# EAGLE design 250100020129x-HW-V2.2 (EAGLE 7.7.0)
Assembly variants: active
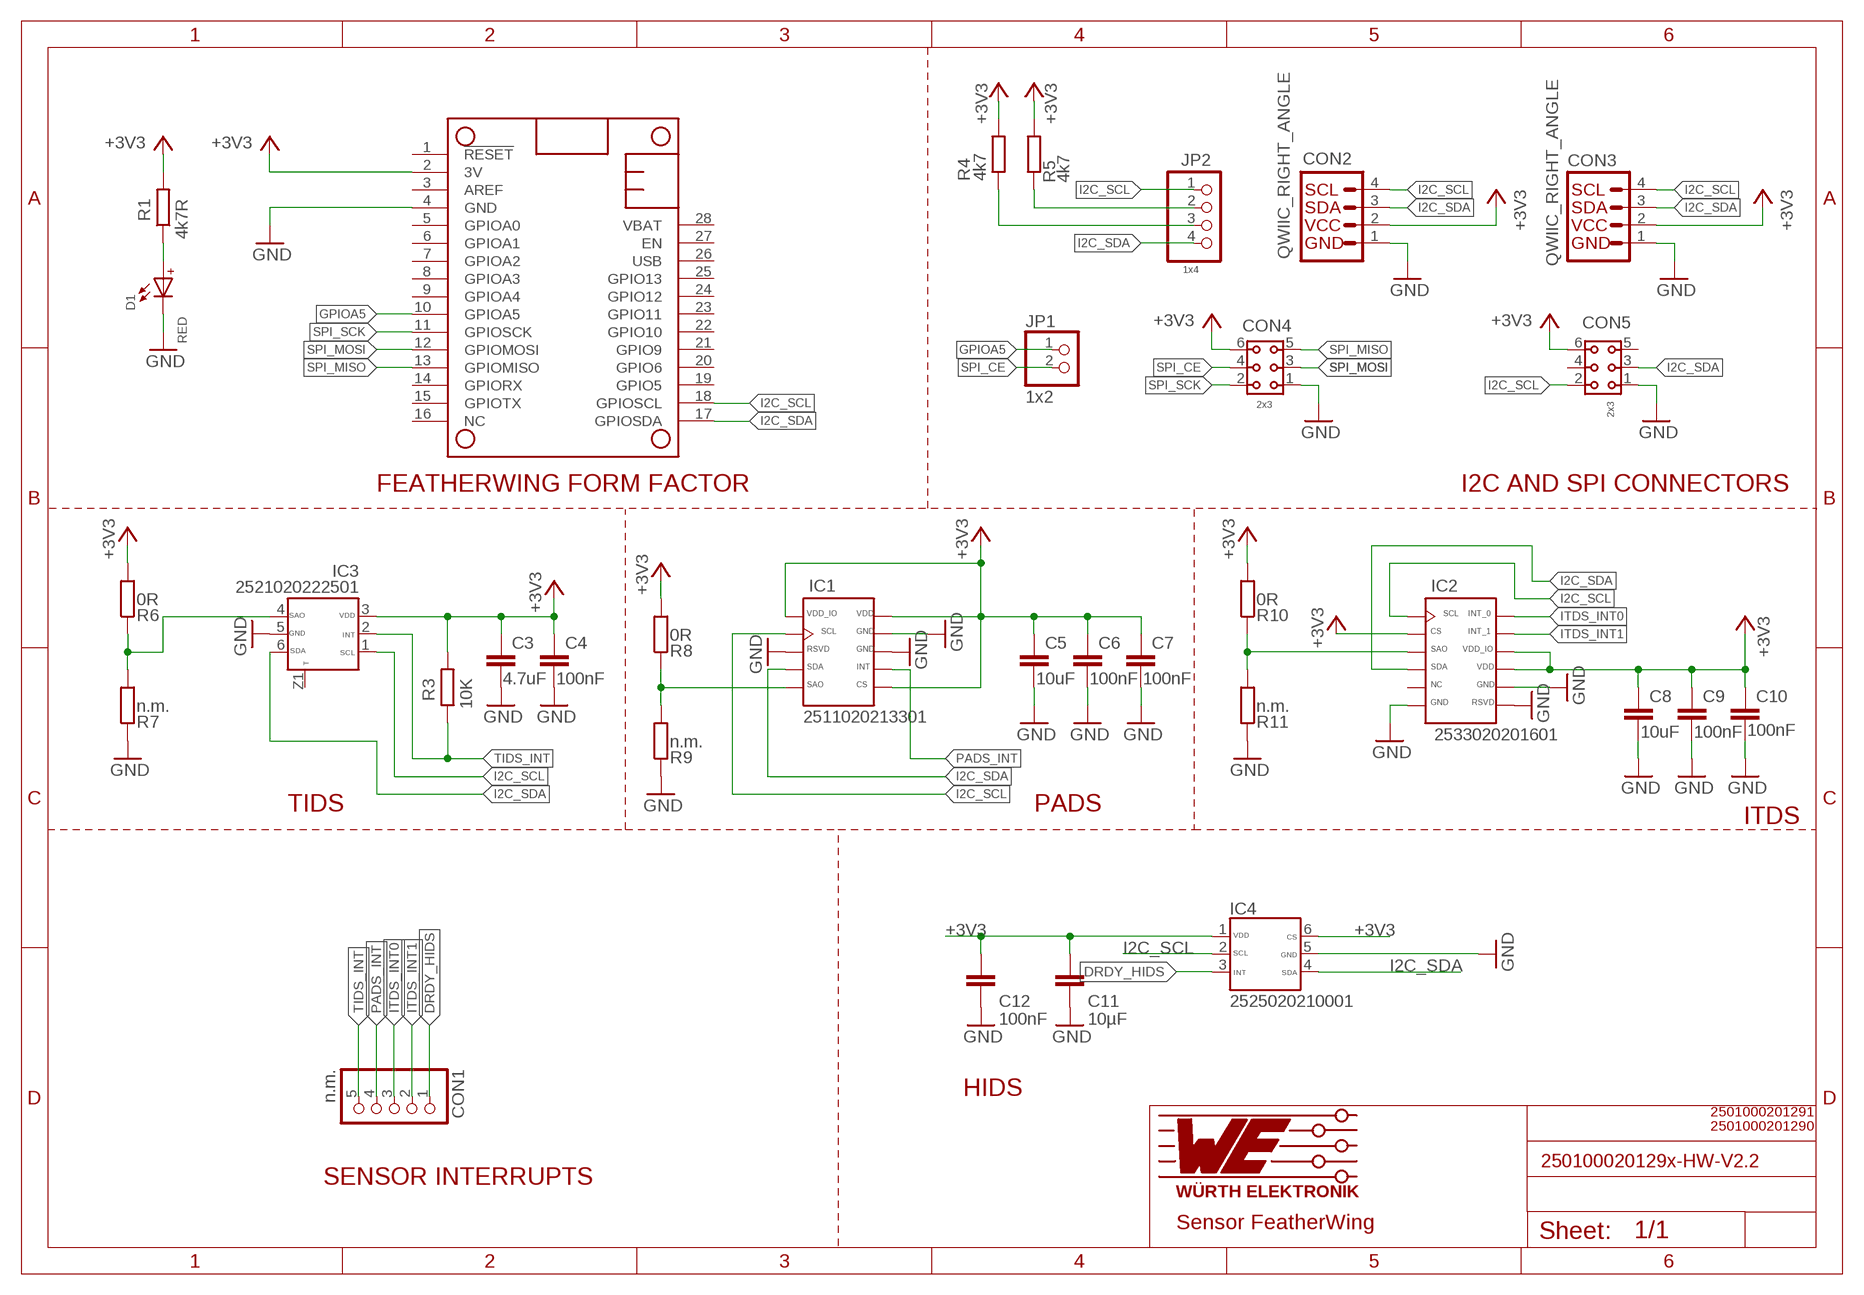
[diagram p0: schematic, sheet 1]

## Parts
C3  4.7uF  C4,7UF0402_IPC  [C0402_IPC]
C4  100nF  C100NF0402_IPC  [C0402_IPC]
C5  10uF  C10UF0402_IPC  [C0402_IPC]
C6  100nF  C100NF0402_IPC  [C0402_IPC]
C7  100nF  C100NF0402_IPC  [C0402_IPC]
C8  10uF  C10UF0402_IPC  [C0402_IPC]
C9  100nF  C100NF0402_IPC  [C0402_IPC]
C10  100nF  C100NF0402_IPC  [C0402_IPC]
C11  10µF  C10UF0402_IPC  [C0402_IPC]
C12  100nF  C100NF0402_IPC  [C0402_IPC]
CON1  n.m.  PINHD-1X5/R  [1X05/R]  (not fitted in variant active)
CON2  QWIIC_RIGHT_ANGLE  QWIIC_CONNECTORJS-1MM  [JST04_1MM_RA]
CON3  QWIIC_RIGHT_ANGLE  QWIIC_CONNECTORJS-1MM  [JST04_1MM_RA]  (not fitted in variant active)
CON4  2x3  6130XX243121_613006243121  [613006243121]  (not fitted in variant active)
CON5  2x3  6130XX243121_613006243121  [613006243121]
D1  RED  WL-SMSW_1204_155124VS73200  [WL-SMSW_1204_A]
IC1  2511020213301  WSEN-PADS_2511020213301  [WSEN-PADS_2511020213301]
IC2  2533020201601  WSEN-ITDS_2533020201601  [WSEN-ITDS_2533020201601]
IC3  2521020222501  WSEN-TIDS_2521020222501  [WSEN-TIDS_2521020222501]
IC4  2525020210001  WSEN-HIDS_2525020210001  [WSEN-HIDS_2525020210001]
JP1  1x2  PINHD-1X2/R  [1X02/R]
JP2  1x4  PINHD-1X4/R  [1X04/R]
MS1  FEATHERWING  [FEATHERWING]
R1  4k7R  R4K70402_IPC  [R0402_IPC]
R3  10K  R10KR0402_IPC  [R0402_IPC]
R4  4k7  R4K70402_IPC  [R0402_IPC]
R5  4k7  R4K70402_IPC  [R0402_IPC]
R6  0R  R0R0402_IPC  [R0402_IPC]
R7  n.m.  R0402_IPC  [R0402_IPC]
R8  0R  R0R0402_IPC  [R0402_IPC]
R9  n.m.  R0402_IPC  [R0402_IPC]
R10  0R  R0R0402_IPC  [R0402_IPC]
R11  n.m.  R0402_IPC  [R0402_IPC]

## Nets
+3V3: C3.1 C4.1 C5.1 C6.1 C7.1 C8.1 C9.1 C10.1 C11.2 C12.2 CON2.2 CON3.2 CON4.6 CON5.6 IC1.1(VDD_IO) IC1.6(CS) IC1.10(VDD) IC2.2(CS) IC2.9(VDD) IC2.10(VDD_IO) IC3.3(VDD) IC4.1(VDD) IC4.6(CS) MS1.2(3V) R1.2 R3.2 R4.2 R5.2 R6.2 R8.2 R10.2
DRDY_HIDS: CON1.1 IC4.3(INT)
GND: C3.2 C4.2 C5.2 C6.2 C7.2 C8.2 C9.2 C10.2 C11.1 C12.1 CON2.1 CON3.1 CON4.1 CON5.1 D1.1(-) IC1.3(RSVD) IC1.8(GND) IC1.9(GND) IC2.6(GND) IC2.7(RSVD) IC2.8(GND) IC3.5(GND) IC4.5(GND) MS1.4(GND) R7.1 R9.1 R11.1
GPIOA5: JP1.1 MS1.10(GPIOA5)
I2C_SCL: CON2.4 CON3.4 CON5.2 IC1.2(SCL) IC2.1(SCL) IC3.1(SCL) IC4.2(SCL) JP2.1 MS1.18(GPIOSCL)
I2C_SDA: CON2.3 CON3.3 CON5.3 IC1.4(SDA) IC2.4(SDA) IC3.6(SDA) IC4.4(SDA) JP2.4 MS1.17(GPIOSDA)
ITDS_INT0: CON1.3 IC2.12(INT_0)
ITDS_INT1: CON1.2 IC2.11(INT_1)
N$1: D1.2(+) R1.1
N$2: JP2.2 R5.1
N$3: JP2.3 R4.1
N$8: IC3.4(SAO) R6.1 R7.2
N$10: IC2.3(SAO) R10.1 R11.2
N$17: IC1.5(SAO) R8.1 R9.2
PADS_INT: CON1.4 IC1.7(INT)
SPI_CE: CON4.4 JP1.2
SPI_MISO: CON4.5 MS1.13(GPIOMISO)
SPI_MOSI: CON4.3 MS1.12(GPIOMOSI)
SPI_SCK: CON4.2 MS1.11(GPIOSCK)
TIDS_INT: CON1.5 IC3.2(INT) R3.1
Unconnected: CON5.4 CON5.5 IC2.5(NC) IC3.Z1 MS1.1(!RESET) MS1.3(AREF) MS1.5(GPIOA0) MS1.6(GPIOA1) MS1.7(GPIOA2) MS1.8(GPIOA3) MS1.9(GPIOA4) MS1.14(GPIORX) MS1.15(GPIOTX) MS1.16(NC) MS1.19(GPIO5) MS1.20(GPIO6) MS1.21(GPIO9) MS1.22(GPIO10) MS1.23(GPIO11) MS1.24(GPIO12) MS1.25(GPIO13) MS1.26(USB) MS1.27(EN) MS1.28(VBAT)

## Notes on the sheet
- FEATHERWING FORM FACTOR | I2C AND SPI CONNECTORS
- TIDS | PADS
- ITDS
- HIDS
- 2501000201291
- 2501000201290
- SENSOR INTERRUPTS
- Sensor FeatherWing

## Library data of the parts
C3 = rcl-amber:C; HEIGHT: 0.5mm; MANUFACTURER: Murata; MAT: X5R; NR: GRM155R60J475ME87J; PACK: 0402; SPG: 6.3V; TOL: 15%
C4 C6 C7 C9 C10 C12 = rcl-amber:C; HEIGHT: 0.5mm; MANUFACTURER: Yageo; MAT: X7R; NR: CC0402KRX7R7BB104; PACK: 0402; SPG: 16V; TOL: 10%
C5 C8 C11 = rcl-amber:C; HEIGHT: 0.5mm; MANUFACTURER: Murata; MAT: X5R; NR: GRM155R60J106ME15J; PACK: 0402; SPG: 6.3V; TOL: 20%
CON1 = pinhead:PINHD-1X5: PIN HEADER; HEIGHT: 8.54mm; MANUFACTURER: Würth Elektronik; NR: 61300511121; PACK: THT; PACKAGING: bag
CON2 CON3 = 250100020129x-HW-V2.0:QWIIC_CONNECTOR: SparkFun I2C Standard Qwiic Connector An SMD 1mm pitch JST connector makes it easy and quick (get it? Qwiic?) to connect I2C devices to each other. The Qwiic system <http://www.sparkfun.com/qwiic> enables fast and solderless connection between popular platforms and various sensors and actuators. We carry 200mm <https://www.sparkfun.com/products/14204>, 100mm <https://www.sparkfun.com/products/14205>, 50mm <https://www.sparkfun.com/products/14206>, and breadboard friendly <https://www.sparkfun.com/products/14207> Qwiic cables. We also offer 10 pcs strips <https://www.sparkfun.com/products/14323> the SMD connectors.; HEIGHT: 2.95mm; MANUFACTURER: JST; MANUFACTURER2: SparkFun Electronics; NR: SM04B-SRSS-TB; NR2: PRT-14417; PACK: SMD
CON4 CON5 = 250100020129x-HW-V2.0:6130XX243121_613006243121: WR-PHD 2.54 mm Angled Dual Socket Header ARTICLE PROPERTIES: Pins:4;? 6;? 8;? 10;? 12;? 14;? 16;? 20;? 22;? 24;? 26;? 32;? 34;? 40;? 64;? 72 KIND PROPERTIES: Pitch:2.54 mm Quality Class:3 as per CECC 75 301-802 Rows:Dual Gender:Socket Header Type:Angled MATERIAL PROPERTIES: Insulator Material :PBT Insulator Flammability Rating:UL94 V-0 Contact Material:Copper Alloy Contact Plating:Gold Contact Type:Stamped GENERAL INFORMATION Operating Temperature:-40 up to +125 °C Compliance:Lead free / RoHS ELECTRICAL PROPERTIES: Rated Current:3 A Withstanding Voltage:500 V (AC) Contact Resistance:20 mO RISO:1000 MO CERTIFICATION UL Approval:E323964 PACKAGING PROPERTIES Packaging:Tray <https://katalog.we-online.com/media/images/v2/o33216v209%20Family_WR-PHD_6130xx243121.jpg> Details see: https://katalog.we-online.com/en/em/PHD_2_54_ANGLED_DUAL_SOCKET_HEADER_6130XX243121 Updated by Yingchun,Shan 2019-10-22 2019 (C) Würth Elektronik; COMMENT: Stick out of PCB; HEIGHT: 5mm; MANUFACTURER: Würth Elektronik; NR: 613006243121; PACK: THT; PACKAGING: Tray
D1 = 155124VS73200_Eagle_WL-SMSW_rev19a:WL-SMSW_1204: SMD Side view mono-color round Characteristics Low power consumption High reliability Low current requirement No UV/IR radiation Wide viewing angle Excelllent for edge lighting displays and backlighting indicators Ideal for miniature applications PBC high-usage Compatible with automatic placement equipment Applications Backlighting for LCD Sidelighting applications Indicator and backlighting for telecommunication Backlighting for symbol, switch and dashboard General use <http://katalog.we-online.de/media/images/v2/Family_WL-SMSW(2).jpg> Details see: http://katalog.we-online.de/en/led/WL-SMSW?m Updated: 2015-04-10 2015 (C) Wurth Elektronik; HEIGHT: 1.5mm; MANUFACTURER: Würth Elektronik; NR: 155124RS73200; PACK: 1204
IC1 = WE_WSEN-Rev3:WSEN-PADS_2511020213301: WSEN-PADS - 2511020213301 Absolute Pressure Sensor Details see: https://katalog.we-online.de/en/wco/WSEN-PADS; HEIGHT: 0.7mm; MANUFACTURER: Würth Elektronik; NR: 2511020213301; PACK: SMD
IC2 = WE_WSEN-Rev3:WSEN-ITDS_2533020201601: WSEN-ITDS - 2533020201601 3 Axis Acceleration Sensor Details see: https://katalog.we-online.de/en/wco/WSEN-ITDS; HEIGHT: 0.7mm; MANUFACTURER: Würth Elektronik; NR: 2533020201601; PACK: SMD
IC3 = WE_WSEN-Rev4:WSEN-TIDS_2521020222501: WSEN-TIDS - 2521020222501 Temperature Sensor Details see: https://katalog.we-online.de/en/wco/WSEN-PADS; HEIGHT: 0.55mm; MANUFACTURER: Würth Elektronik; NR: 2521020222501; PACK: SMD
IC4 = WE_WSEN-Rev4.1:WSEN-HIDS_2525020210001: WSEN-HIDS - 2525020210001 Humidity Sensor with integrated Temperature Sensor Details see: https://www.we-online.de/katalog/en/WSEN-HIDS; HEIGHT: 1.0mm; MANUFACTURER: Würth Elektronik; NR: 2525020210001; PACK: SMD
JP1 = pinhead:PINHD-1X2: PIN HEADER; HEIGHT: 8.54mm; MANUFACTURER: Würth Elektronik; NR: 61300211121; PACK: THT; PACKAGING: bag
JP2 = pinhead:PINHD-1X4: PIN HEADER; COMMENT: 2xJumper, 1-2, 3-4; HEIGHT: 8.54mm; MANUFACTURER: Würth Elektronik; NR: 61300411121; PACKAGING: bag
MS1 = adafruit:FEATHERWING; COMMENT: header: 1 x 12 & 1 x 16, stackup, pins clean; MANUFACTURER: Adafruit; NR: 2830
R1 R4 R5 = rcl-amber:R; HEIGHT: 0.35mm; MANUFACTURER: Yageo; NR: RC0402FR-074K7L; P: 0.063W; PACK: 0402; TOL: 1%
R3 = rcl-amber:R; HEIGHT: 0.35mm; MANUFACTURER: Yageo; NR: RC0402FR-0710KL; PACK: 0402; TOL: 1%
R6 R8 R10 = rcl-amber:R; HEIGHT: 0.35mm; MANUFACTURER: Yageo; NR: RC0402FR-070RL; PACK: 0402; TOL: 5%
R7 R9 R11 = rcl-amber:R; HEIGHT: 0.35mm; MANUFACTURER: Yageo; PACK: 0402

## Board
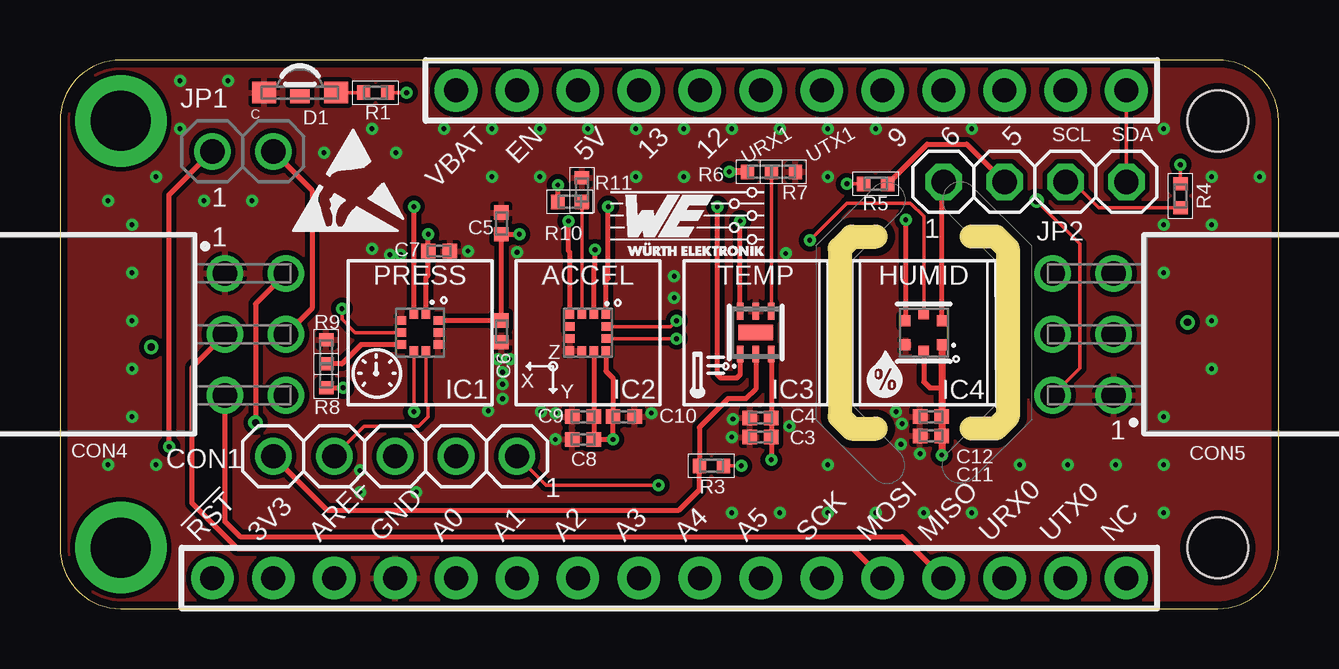
[diagram p1: board, top side]
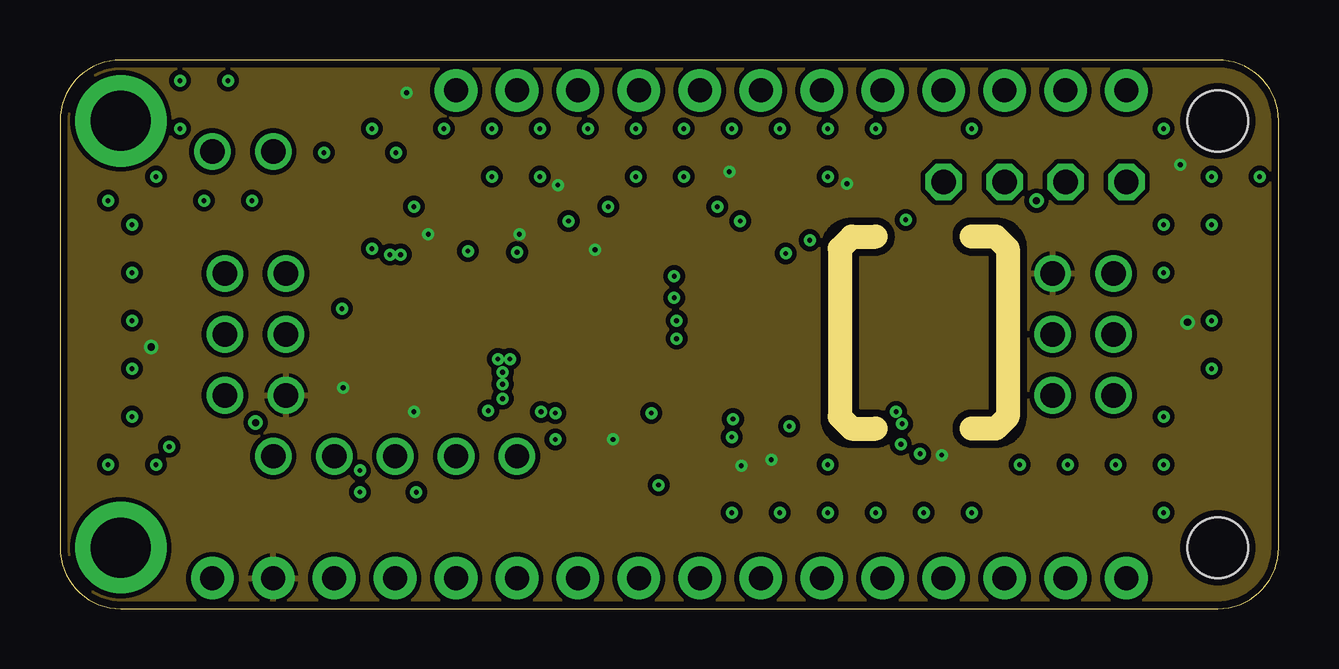
[diagram p2: board, inner layer Route2]
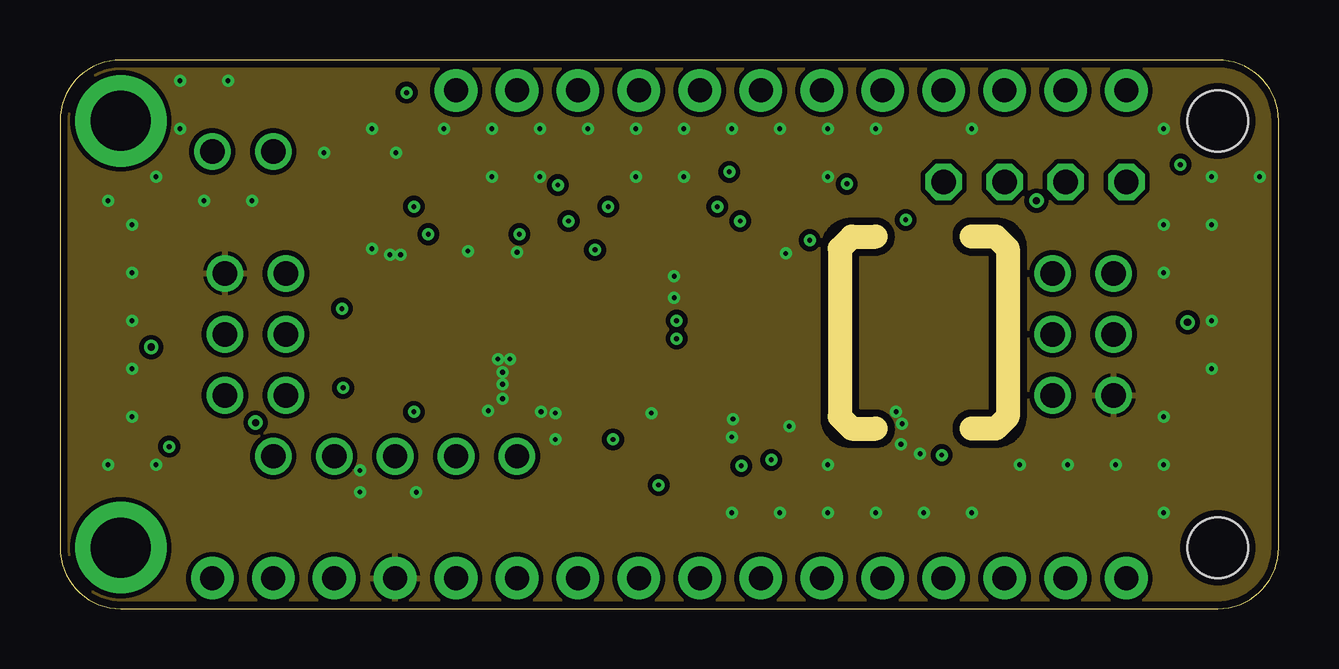
[diagram p3: board, inner layer Route15]
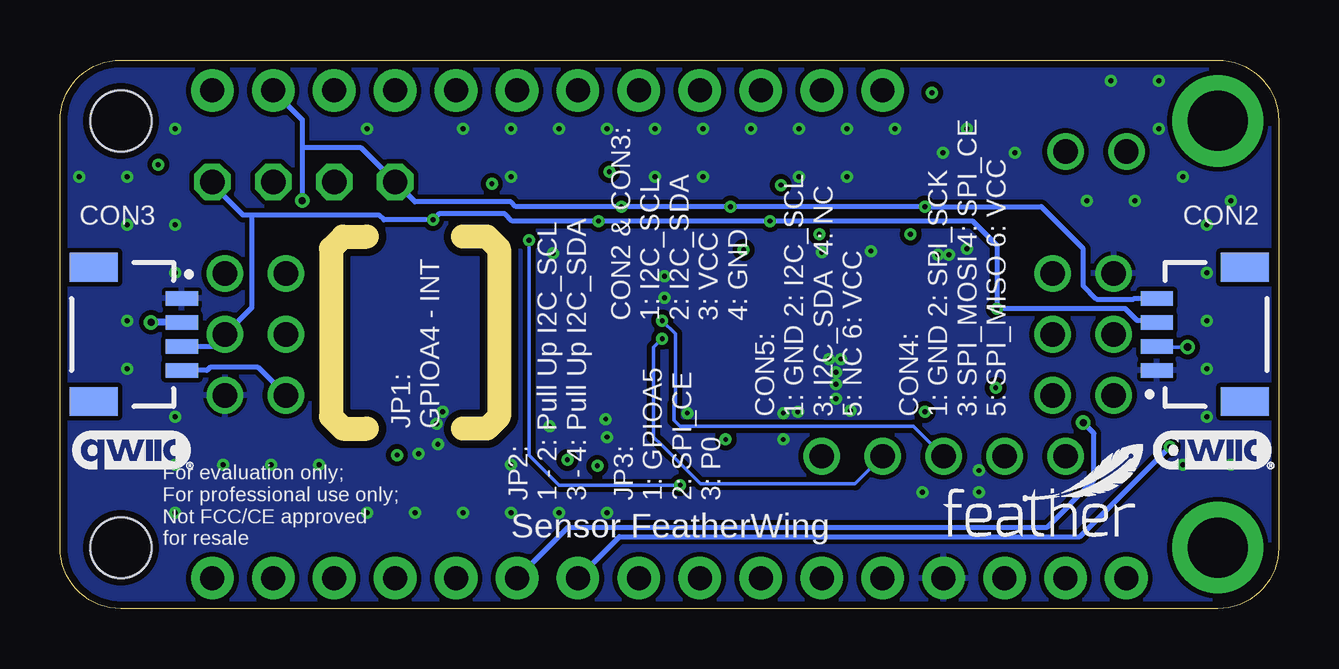
[diagram p4: board, bottom side, seen from below]

Size 50.8 x 22.86 mm. Coordinates in mm from the lower left corner, seen from the top.
Copper layers (1+2*15+16): Top 0.035mm / dielectric 0.376mm / Route2 0.035mm / dielectric 0.71mm / Route15 0.035mm / dielectric 0.376mm / Bottom 0.035mm
Design rules "default *": minimum track width 0.15mm, minimum drill 0.2mm, track to track 0.2mm, track to pad 0.2mm, pad to pad 0.2mm, via to via 0.2mm, smd to smd 0.2mm, copper to edge 0.3mm, drill to drill 5mil, minimum pad ring 10mil, minimum via ring 0.15mm, stop-mask expansion 0.05mm, vias tented up to drill 20mil, thermal gap 6mil
tKeepout: area 20.5,8.9 to 26.4,14.5; area 13,8.5 to 19,14.5; area 27.5,8.5 to 33.5,14.5
bKeepout: area 27.5,8.5 to 33.5,14.5; area 20.5,8.5 to 26.4,14.5; area 13,8.5 to 19,14.5
tRestrict: 10 lines
bRestrict: 10 lines
vRestrict: 10 lines
Milling: 10 lines

### Footprints (pad centres in the part's own frame; a part is rotated, then mirrored left to right if it is on the bottom)
C0402_IPC = smd 0.6 x 0.6: 1 -0.45,0; 2 0.45,0
1X05/R = drill 1.016: 1 -5.08,0; 2 -2.54,0; 3 0,0; 4 2.54,0; 5 5.08,0
JST04_1MM_RA = smd 0.6 x 1.35: 1 -1.5,0; 2 -0.5,0; 3 0.5,0; 4 1.5,0 | smd 1.2 x 2: NC1 2.8,-3.675; NC2 -2.8,-3.675
613006243121 = drill 1.02: 1 -2.54,5.61; 2 -2.54,8.15; 3 0,5.61; 4 0,8.15; 5 2.54,5.61; 6 2.54,8.15
WL-SMSW_1204_A = smd 1 x 0.9: 1 -1.5,0; 2 1.5,0 | smd 0.8 x 0.6: 3 0,-0.15
WSEN-PADS_2511020213301 = smd 0.375 x 0.35: 1 -0.762,0.25; 2 -0.762,-0.25; 6 0.762,-0.25; 7 0.762,0.25 | smd 0.35 x 0.375: 3 -0.5,-0.762; 4 0,-0.762; 5 0.5,-0.762; 8 0.5,0.762; 9 0,0.762; 10 -0.5,0.762
WSEN-ITDS_2533020201601 = smd 0.375 x 0.35: 1 -0.762,0.75; 2 -0.762,0.25; 3 -0.762,-0.25; 4 -0.762,-0.75; 7 0.762,-0.75; 8 0.762,-0.25; 9 0.762,0.25; 10 0.762,0.75 | smd 0.35 x 0.375: 5 -0.25,-0.75; 6 0.25,-0.75; 11 0.25,0.75; 12 -0.25,0.75
WSEN-TIDS_2521020222501 = smd 0.7 x 0.27: 1 -0.89,0.65; 2 -0.89,0; 3 -0.89,-0.65; 4 0.89,-0.65; 5 0.89,0; 6 0.89,0.65 | smd 0.65 x 1.45: Z1 0,0
WSEN-HIDS_2525020210001 = smd 0.4 x 0.45: 1 -0.75,0.5; 2 -0.75,-0.5; 4 0.75,-0.5; 5 0.75,0.5 | smd 0.45 x 0.4: 3 0,-0.75; 6 0,0.75
1X02/R = drill 1.016: 1 -1.27,0; 2 1.27,0
1X04/R = drill 1.016 octagon: 1 -3.81,0; 2 -1.27,0; 3 1.27,0; 4 3.81,0
FEATHERWING = drill 1 pad 1.778: 1 6.35,1.27; 2 8.89,1.27; 3 11.43,1.27; 4 13.97,1.27; 5 16.51,1.27; 6 19.05,1.27; 7 21.59,1.27; 8 24.13,1.27; 9 26.67,1.27; 10 29.21,1.27; 11 31.75,1.27; 12 34.29,1.27; 13 36.83,1.27; 14 39.37,1.27; 15 41.91,1.27; 16 44.45,1.27; 17 44.45,21.59; 18 41.91,21.59; 19 39.37,21.59; 20 36.83,21.59; 21 34.29,21.59; 22 31.75,21.59; 23 29.21,21.59; 24 26.67,21.59; 25 24.13,21.59; 26 21.59,21.59; 27 19.05,21.59; 28 16.51,21.59 | drill 2.5 pad 3.81: P$1 2.54,20.32; P$2 2.54,2.54 | hole 2.54: 48.26,20.32; 48.26,2.54
R0402_IPC = smd 0.55 x 0.6: 1 -0.5,0; 2 0.5,0

### Placement (x,y rotation side)
C3  29.2,7.15 180 top
C4  29.2,7.95 180 top
C5  18.4,16.05 90 top
C6  18.4,11.55 270 top
C7  15.8,14.9 0 top
C8  21.8,7.05 180 top
C9  21.8,8 180 top
C10  23.5,8 0 top
C11  36.3,7.2 0 top
C12  36.3,8 0 top
CON1  13.97,6.35 180 top
CON2  5.08,11.43 90 bottom
CON3  45.72,11.43 270 bottom
CON4  1.27,11.43 270 top
CON5  49.53,11.43 90 top
D1  10,21.5 0 top
IC1  15,11.5 270 top
IC2  22,11.5 270 top
IC3  29,11.5 90 top
IC4  36,11.5 180 top
JP1  7.62,19.05 0 top
JP2  40.64,17.78 0 top
MS1  0,0 0 top
R1  13.15,21.5 0 top
R3  27.15,5.95 0 top
R4  46.7,17.2 90 top
R5  34,17.7 180 top
R6  29.15,18.2 180 top
R7  30.15,18.2 180 top
R8  11.1,9.7 270 top
R9  11.1,10.7 270 top
R10  21.25,16.95 180 top
R11  21.75,17.45 270 top
U$1  [QWICC_5MM]  50.3,5.8 0 bottom
U$2  [WE-LOGO-6MM_TNAME]  22.95,14.7 0 top
U$3  [HIDS_2MM]  33.65,8.8 0 top
U$4  [ESD_5MM]  9.6,15.65 0 top
U$6  [FEATHER_8MM]  14,3 0 bottom
U$7  [TIDS_2MM]  26.25,8.75 0 top
U$8  [PADS_2.2MM]  12.15,8.7 0 top
U$9  [QWICC_5MM]  5.25,5.8 0 bottom

### Tracks (layer width: path | path; a pad name or v marks a point on that pad's centre or on a via)
+3V3  (via drill 0.2, 0.3)
  Top 0.152: v32.8,17.7 R5.2 | R4.2 v46.7,18.5 | R1.2 v14.45,21.5 | R3.2 v28.4,5.95 | IC1.6 v14.75,8.2
  Top 0.2: v19.15,15.6 C5.1 C6.1 IC1.10 | v15.35,15.6 C7.1 15.35,13.9 15.25,13.8 IC1.1 | IC2.9 C9.1 C8.1 v23.05,7.05 C10.1 23.05,9.6 22.75,9.9 IC2.10 | v29.65,6.2 C3.1 C4.1 IC3.3 | R8.2 v11.8,9.2 | IC4.6 36,9.45 36.25,9.2 36.75,9.2 | R10.2 v20.75,17.65 | IC2.2 22.25,14.15 22.3,14.2 v22.3,14.95
  Top 0.3: R6.2 v27.9,18.2 | IC4.1 36.75,9.2 C12.2 C11.2 v36.75,6.4
  Bottom 0.152: CON2.2 5.05,10.9 v3.8,10.9
  Bottom 0.3: CON3.2 v47,11.93
  pour Route2: 50.8,20.36 50.8,2.59 arc-90 48.21,0 2.44,0 arc-90 0,2.44 0,20.38 arc-90 2.48,22.86 48.3,22.86 arc-90
DRDY_HIDS  (via drill 0.2)
  Top 0.15: IC4.3 36,16.35 35.45,16.9 32.8,16.9 v31.25,15.35 | v24.95,5.15 20.25,5.15 CON1.1
  Bottom 0.15: v31.25,15.35 31.25,6.4 30,5.15 v24.95,5.15
GND  (via drill 0.2, 0.2 pad 0.3)
  other vias: 14.85,4.85 17,14.9 18.45,9.85 18.45,8.75 17.85,8.25 13.75,14.75 14.2,14.75 18.25,10.4 18.75,10.4 20.05,8.2 19.05,14.85 18.45,9.35 20.65,8.15 20.65,7.05 24.65,8.15 28,7.15 28.05,7.9 30.25,14.8 12.5,5.76 12.5,4.86 34.85,8.2 35.1,7.7 35.85,6.45 35.05,6.85 30.4,7.6 25.6,12.95 25.6,13.85 24,18 26,18 20,18 18,18 16,20 18,20 20,20 22,20 24,20 26,20 28,20 30,20 32,20 32,18 34,20 38,20 46,20 50,18 48,18 48,16 46,16 46,14 48,12 48,10 46,8 46,6 46,4 44,6 42,6 40,6 38,4 36,4 34,4 32,4 32,6 30,4 28,4 4,6 2,6 3,8 3,10 3,12 3,14 3,16 2,17 4,18 6,17 8,17 11,19 7,22 5,22 5,20 13,20 14,19 13,15
  pour Bottom: 0,12.06 0,20.32 arc-90 2.54,22.86 48.26,22.86 arc-90 50.8,20.32 50.8,2.67 arc-90 48.13,0 2.41,0 arc-90 0,2.41
  pour Top: 50.8,20.35 50.8,2.51 arc-90 48.29,0 2.45,0 arc-90 0,2.45 0,20.31 arc-90 2.55,22.86 48.29,22.86 arc-90
  pour Route15: 50.8,20.41 50.8,2.5 arc-90 48.3,0 2.45,0 arc-90 0,2.45 0,20.36 arc-90 2.5,22.86 48.35,22.86 arc-90
GPIOA5  (via drill 0.2)
  Top 0.2: v4.55,6.75 4.55,17.25 JP1.1
  Bottom 0.2: MS1.10 27.48,3 8.3,3 v4.55,6.75
I2C_SCL  (via drill 0.2, 0.3)
  Top 0.152: v40.7,17 42.5,15.2 42.5,10.01 CON5.2
  Top 0.2: IC1.2 v14.75,16.75 | IC2.1 22.75,13.65 22.85,13.75 v22.85,16.75 | IC3.1 28.35,9.75 28.2,9.6 27.55,9.6 27.4,9.75 v27.4,16.75 | IC4.2 36.75,17.7 JP2.1
  Bottom 0.2: MS1.18 40.7,20.38 40.7,19.2 | 40.7,19.2 v40.7,17 | CON2.4 6.02,12.93 6.05,12.9 7.6,12.9 8.15,13.45 8.15,15 9.9,16.75 v14.75,16.75 v22.85,16.75 v27.4,16.75 31.8,16.75 32,16.95 36,16.95 JP2.1 38.25,19.2 40.7,19.2 | CON5.2 42.54,10.05 44.55,10.05 44.67,9.93 CON3.4
I2C_SDA  (via drill 0.2)
  Top 0.15: IC1.4 12.3,11.5 11.75,12.05 v11.75,12.5
  Top 0.152: MS1.17 JP2.4
  Top 0.2: IC3.6 v28.35,16.15 | IC2.4 21.25,14.85 21.2,14.9 v21.2,16.15 | IC4.4 v35.25,16.2
  Bottom 0.152: CON2.3 5.15,12
  Bottom 0.2: 42.85,16.4 37.5,16.4 37.3,16.2 v35.25,16.2 35,16.45 32.25,16.45 31.95,16.15 v28.35,16.15 v21.2,16.15 12.75,16.15 11.75,15.15 v11.75,12.5 6.4,12.5 5.9,12 5.15,12 | 42.85,16.4 43.17,16.4 44.45,17.68 JP2.4 | CON3.3 44.42,10.93 CON5.3 42.8,12.55 42.8,16.35 42.85,16.4
ITDS_INT0  (via drill 0.2)
  Top 0.152: IC2.12 25.45,11.75 v25.7,12
  Bottom 0.15: 19.05,7.6 15.22,7.6 CON1.3
  Bottom 0.152: v25.7,12 25.15,11.45 25.15,8.55 25.2,8.5 25.2,7.85 24.95,7.6 19.05,7.6
ITDS_INT1  (via drill 0.2)
  Top 0.152: IC2.11 v25.7,11.25
  Bottom 0.15: CON1.2 17.66,5.2 24.1,5.2 25.73,6.83
  Bottom 0.152: 25.4,6.5 25.73,6.83 26.05,7.15 26.05,10.9 v25.7,11.25
N$1
  Top 0.152: D1.2 R1.1 12.5,21.49
N$2
  Top 0.2: R5.1 36.15,19.35 37.8,19.35 JP2.2
N$3
  Top 0.152: JP2.3 42.22,17.78 43.3,16.7 R4.1
N$6
  cutout Route2: 37.95,16.25 arc90 37.25,15.55 37.25,15.5 arc90 38,14.75 38.65,14.75 38.7,14.75 38.75,14.7 38.75,8.3 38.7,8.25 38,8.25 arc90 37.25,7.5 arc90 38,6.75 38.2,6.75 39,6.75 arc90 40.25,8 40.25,8.3 40.25,15.05 arc90 39.05,16.25
  cutout Route15: 37.95,16.25 arc90 37.25,15.55 37.25,15.5 arc90 38,14.75 38.65,14.75 38.7,14.75 38.75,14.7 38.75,8.3 38.7,8.25 38,8.25 arc90 37.25,7.5 arc90 38,6.75 38.2,6.75 39,6.75 arc90 40.25,8 40.25,8.3 40.25,15.05 arc90 39.05,16.25
  cutout Route15: 34.05,6.75 arc90 34.75,7.45 34.75,7.5 arc90 34,8.25 33.35,8.25 33.3,8.25 33.25,8.3 33.25,14.7 33.3,14.75 34,14.75 arc90 34.75,15.5 arc90 34,16.25 33.8,16.25 33,16.25 arc90 31.75,15 31.75,14.7 31.75,7.95 arc90 32.95,6.75
  cutout Route2: 34.05,6.75 arc90 34.75,7.45 34.75,7.5 arc90 34,8.25 33.35,8.25 33.3,8.25 33.25,8.3 33.25,14.7 33.3,14.75 34,14.75 arc90 34.75,15.5 arc90 34,16.25 33.8,16.25 33,16.25 arc90 31.75,15 31.75,14.7 31.75,7.95 arc90 32.95,6.75
N$8
  Top 0.15: IC3.4 R7.2
N$10
  Top 0.152: IC2.3 R11.2
N$17
  Top 0.2: R9.2 11.75,10.2 12.55,11 IC1.5
PADS_INT
  Top 0.15: 15.25,9.9 15.25,8.55 15.35,8.45 15.35,8 14.95,7.6 12.68,7.6 CON1.4
  Top 0.152: IC1.7 15.25,9.9
SPI_CE
  Top 0.2: JP1.2 10.5,17.44 10.5,12.51 CON4.4
SPI_MISO
  Top 0.2: MS1.13 35.1,3 7.5,3 6.88,3.62 CON4.5
SPI_MOSI
  Top 0.2: MS1.12 33.06,2.5 7.4,2.5 5.5,4.4 5.5,10.05 CON4.3
SPI_SCK  (via drill 0.3)
  Top 0.2: CON4.2 8.15,12.7 v8.15,7.75
  Bottom 0.2: MS1.11 29.62,3.4 9.65,3.4 7.7,5.35 7.7,7.3 v8.15,7.75
TIDS_INT
  Top 0.15: 26.6,6 R3.1
  Top 0.2: IC3.2 29,9.15 28.6,8.75 27.85,8.75 26.65,7.55 R3.1 26.65,4.95 25.8,4.1 11.14,4.1 CON1.5

### Text on the board
tNames: VBAT | EN | 5V | 13 | 12 | URX1 | UTX1 | 9 | 6 | 5 | SCL | SDA | 1 | 1 | 1 | PRESS | ACCEL | TEMP | HUMID | Z | X | Y | 1 | 1 | !RST | 3V3 | AREF | GND | A0 | A1 | A2 | A3 | A4 | A5 | SCK | MOSI | MISO | URX0 | UTX0 | NC
bNames: CON2 & CON3: / 1: I2C_SCL / 2: I2C_SDA / 3: VCC / 4: GND | CON4: / 1: GND 2: SPI_SCK / 3: SPI_MOSI 4: SPI_CE / 5: SPI_MISO 6: VCC | CON5: / 1: GND 2: I2C_SCL / 3: I2C_SDA 4: NC / 5: NC 6: VCC | JP1: / GPIOA4 - INT | For evaluation only; / For professional use only; / Not FCC/CE approved / for resale | JP3: / 1: GPIOA5 / 2: SPI_CE / 3: P0 | JP2: / 1 - 2: Pull Up I2C_SCL / 3 - 4: Pull Up I2C_SDA | Sensor FeatherWing
tValues: 270R